# Altium project Edge_logic_analyzer_P1.PrjPcb (part 1 of 3)
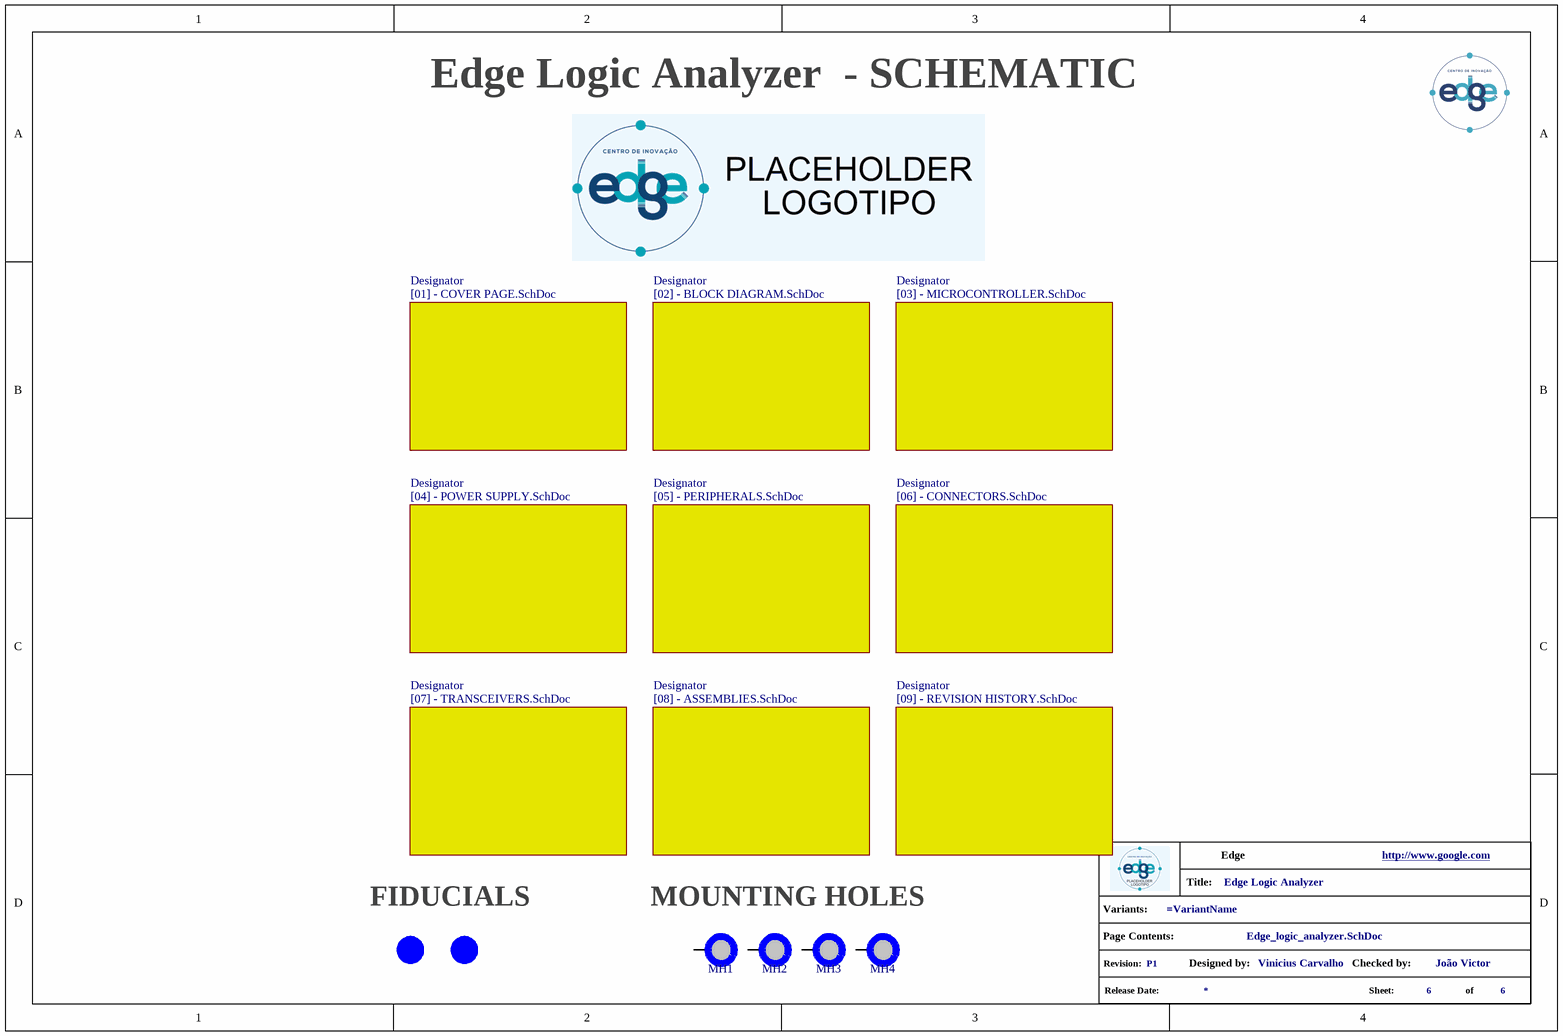
[diagram p0: Edge_logic_analyzer.SchDoc]
CheckedProject: João Victor; Company: Edge; DesignedProject: Vinicius Carvalho; TitleProject: Edge Logic Analyzer; VersionRevision: P1; Website: http://www.google.com
10 sheets, 126 parts. Net scope: flat (ports and power ports of the same name join across sheets).
Board file: Edge_logic_analyzer.PcbDoc
Sheets:
  Edge_logic_analyzer.SchDoc
    Designator = [02] - BLOCK DIAGRAM.SchDoc
    Designator = [03] - MICROCONTROLLER.SchDoc
    Designator = [01] - COVER PAGE.SchDoc
    Designator = [04] - POWER SUPPLY.SchDoc
    Designator = [06] - CONNECTORS.SchDoc
    Designator = [05] - PERIPHERALS.SchDoc
    Designator = [07] - TRANSCEIVERS.SchDoc
    Designator = [09] - REVISION HISTORY.SchDoc
    Designator = [08] - ASSEMBLIES.SchDoc

## Sheet Edge_logic_analyzer.SchDoc
size A4; DocumentNumber: 6; SheetNumber: 6; SheetTotal: 6

### Parts
(Parts that share a designator on the sheet are numbered #1, #2 ... from top to bottom, then left to right.)
*?#1  info_project  (value not drawn)  (graphical)
FID1  FID_40X1.20  [FID_40X1.20]  (value not drawn)  (no BOM)
FID2  FID_40X1.20  [FID_40X1.20]  (value not drawn)  (no BOM)
MH1  MH_7.4MMC_3.2MMD  [MH_7.4MMC_3.2MMD]  (value not drawn)  (no BOM)
MH2  MH_7.4MMC_3.2MMD  [MH_7.4MMC_3.2MMD]  (value not drawn)  (no BOM)
MH3  MH_7.4MMC_3.2MMD  [MH_7.4MMC_3.2MMD]  (value not drawn)  (no BOM)
MH4  MH_7.4MMC_3.2MMD  [MH_7.4MMC_3.2MMD]  (value not drawn)  (no BOM)

### Sub-sheets
Designator = [02] - BLOCK DIAGRAM.SchDoc: no entries
Designator = [03] - MICROCONTROLLER.SchDoc: no entries
Designator = [01] - COVER PAGE.SchDoc: no entries
Designator = [04] - POWER SUPPLY.SchDoc: no entries
Designator = [06] - CONNECTORS.SchDoc: no entries
Designator = [05] - PERIPHERALS.SchDoc: no entries
Designator = [07] - TRANSCEIVERS.SchDoc: no entries
Designator = [09] - REVISION HISTORY.SchDoc: no entries
Designator = [08] - ASSEMBLIES.SchDoc: no entries

### Nets

Not connected (* = marked no-connect by the designer): MH1 1; MH2 1; MH3 1; MH4 1

### Notes on the sheet
- - SCHEMATIC
- FIDUCIALS
- MOUNTING HOLES
- (in symbol info_project) Title:; Variants:; Page Contents:; Revision:; Designed by:; Checked by:; Release Date:; Sheet:; of

### Library data of the parts
FID1 FID2 = FID_40X1.20: Fiducials
MH1-MH4 = MH_7.4MMC_3.2MMD: Mounting Hole 7.4mm Diameter 3.2mm Drill

## Sheet [02] - BLOCK DIAGRAM.SchDoc
size A2; DocumentNumber: 2; SheetNumber: 2; SheetTotal: 6; PageSetup: Record=PageOptions|CenterHorizontal=True|CenterVertical=True|PrintScale=0.52|XCorrection=1.00|YCorrection=1.00|PrintKind=1|BorderSize=5000000|LeftOffset=0|BottomOffset=0|Orientation=2|PaperLength=1000|PaperWidth=1000|Scale=100|PaperSource=4|PrintQuality=600|MediaType=1|DitherType=10|PrintScaleMode=1|PaperKind=A4|PaperIndex=9
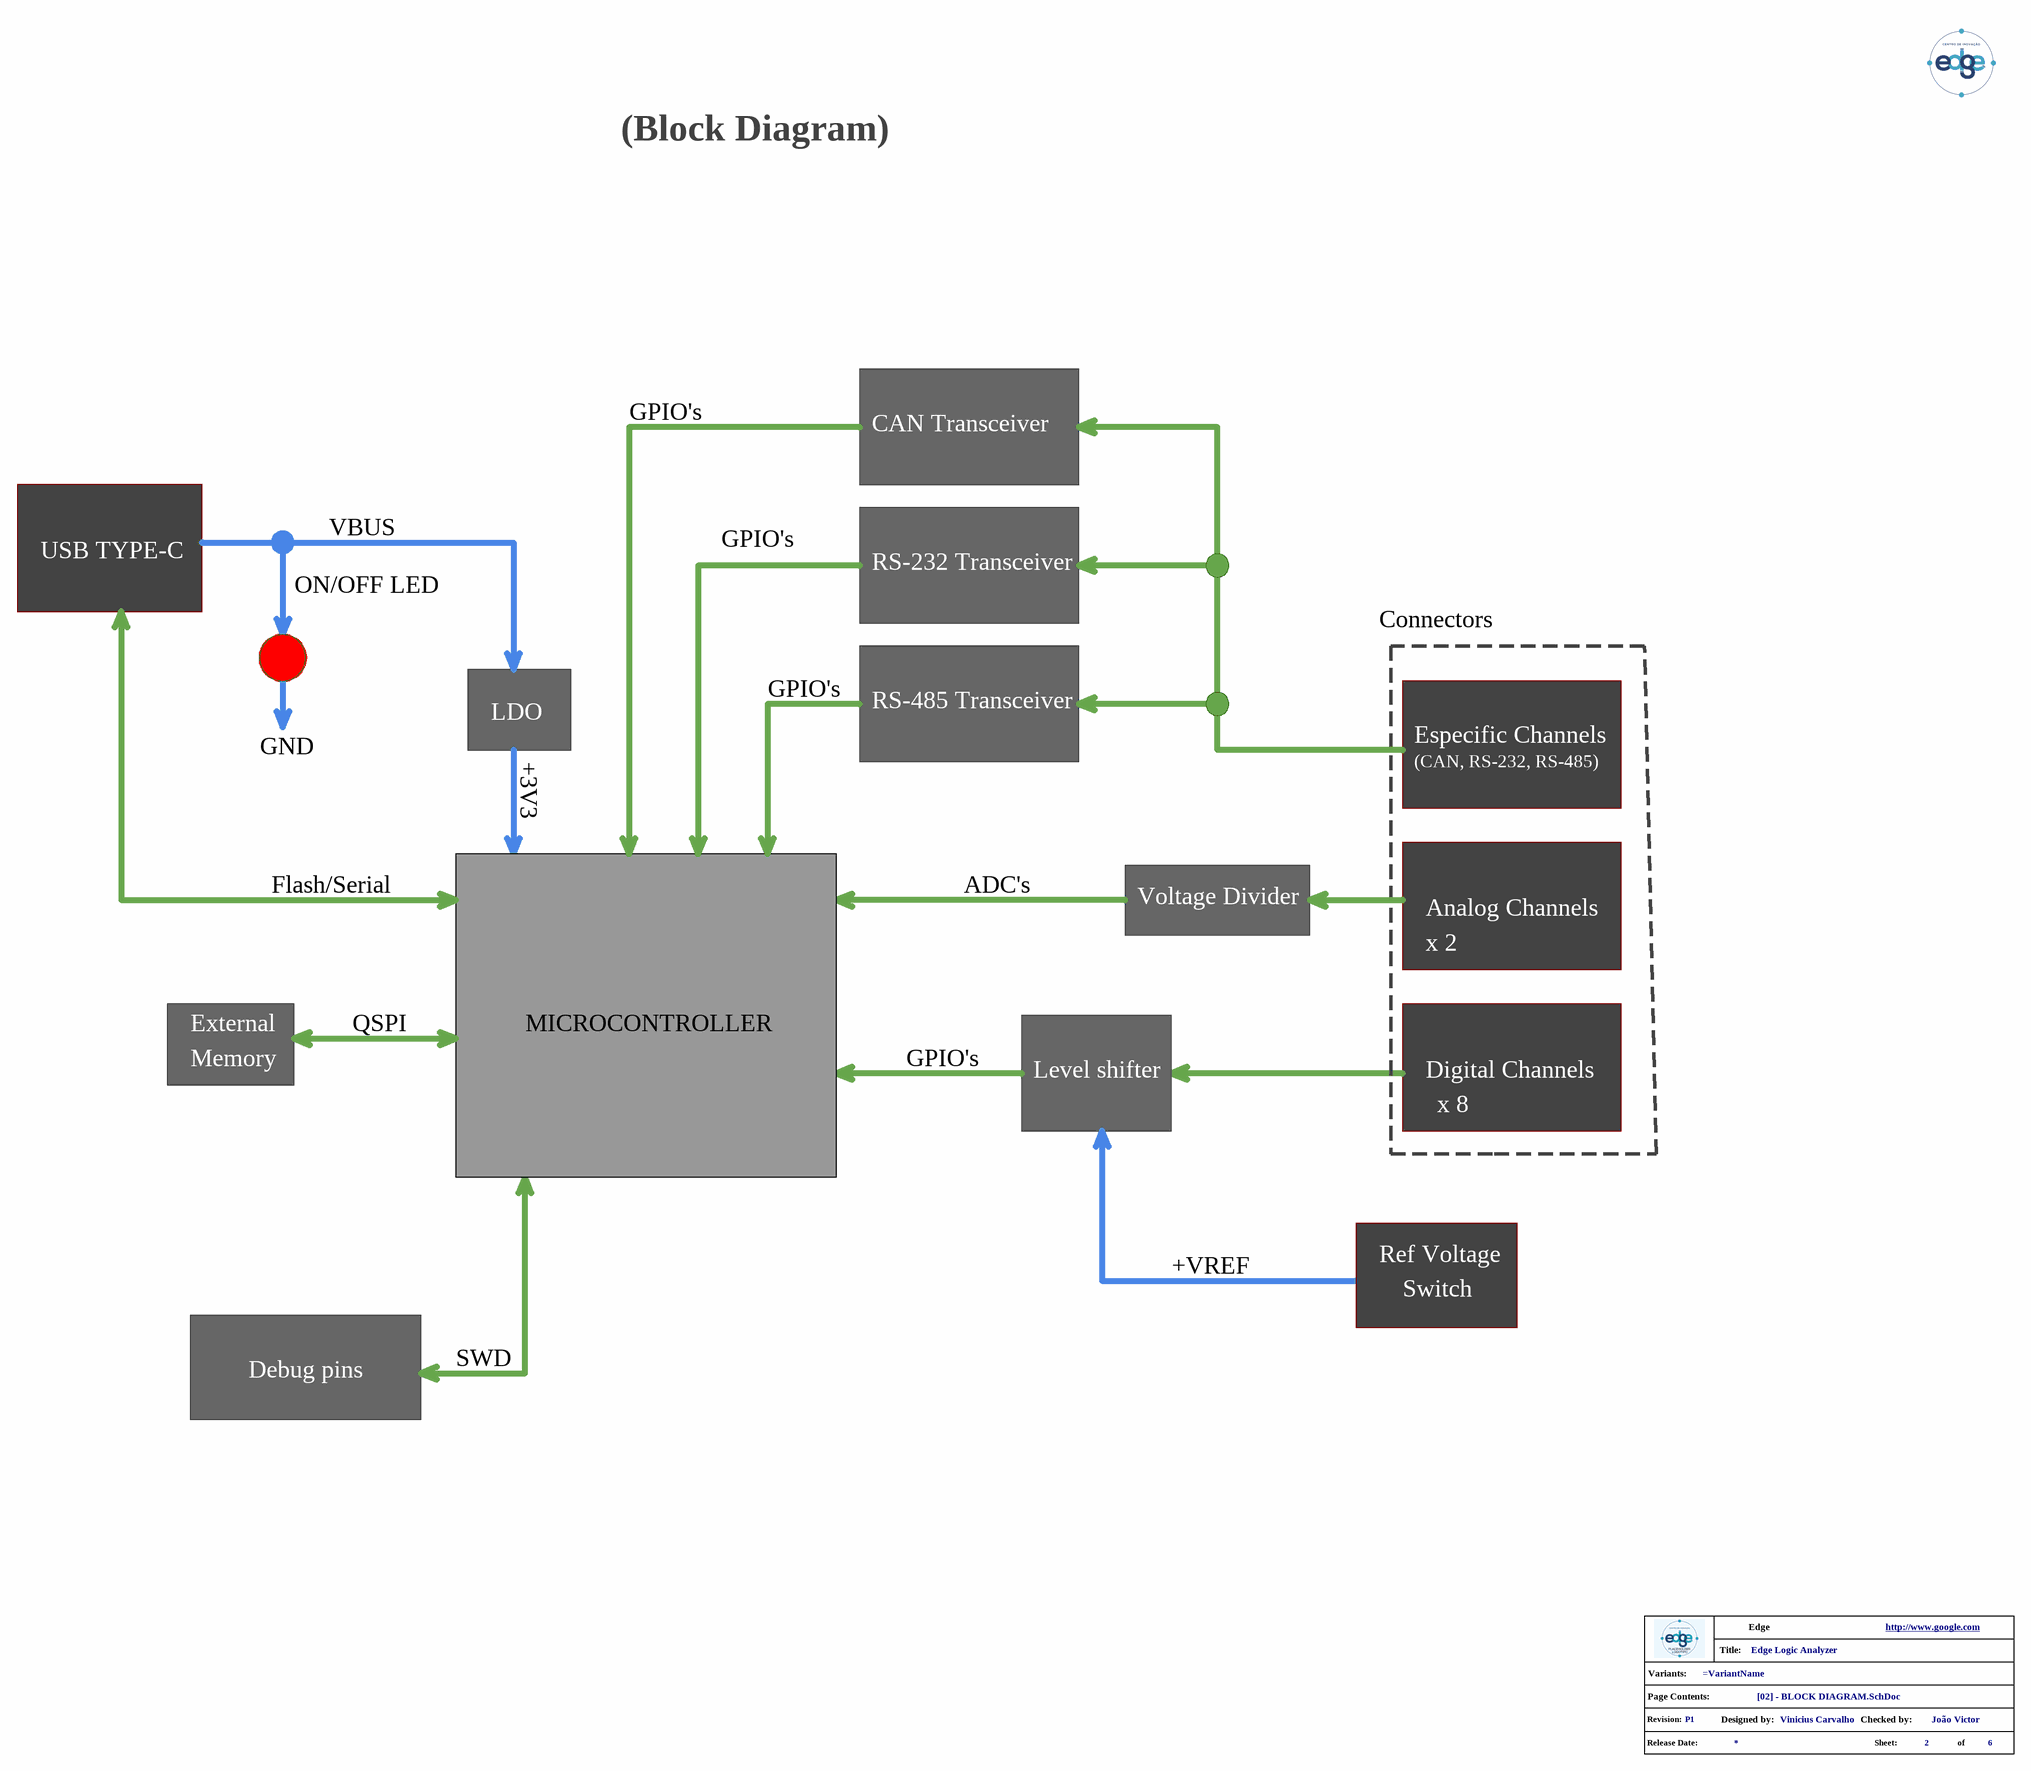
[diagram p1: [02] - BLOCK DIAGRAM.SchDoc]

### Parts
(Parts that share a designator on the sheet are numbered #1, #2 ... from top to bottom, then left to right.)
*?#2  info_project  (value not drawn)  (graphical)

### Notes on the sheet
- (Block Diagram)
- GPIO's
- CAN Transceiver
- VBUS
- USB TYPE-C
- ON/OFF LED
- RS-232 Transceiver
- Connectors
- RS-485 Transceiver
- GND
- LDO
- +3V3
- Especific Channels
- (CAN, RS-232, RS-485)
- Flash/Serial
- ADC's
- Voltage Divider
- Analog Channels
- x 2
- External
- QSPI
- MICROCONTROLLER
- Memory
- Level shifter
- Digital Channels
- x 8
- +VREF
- Ref Voltage
- Switch
- Debug pins
- SWD
- (in symbol info_project) Title:; Variants:; Page Contents:; Revision:; Designed by:; Checked by:; Release Date:; Sheet:; of

## Sheet [03] - MICROCONTROLLER.SchDoc
size A3; DocumentNumber: 3; SheetNumber: 3; SheetTotal: 6
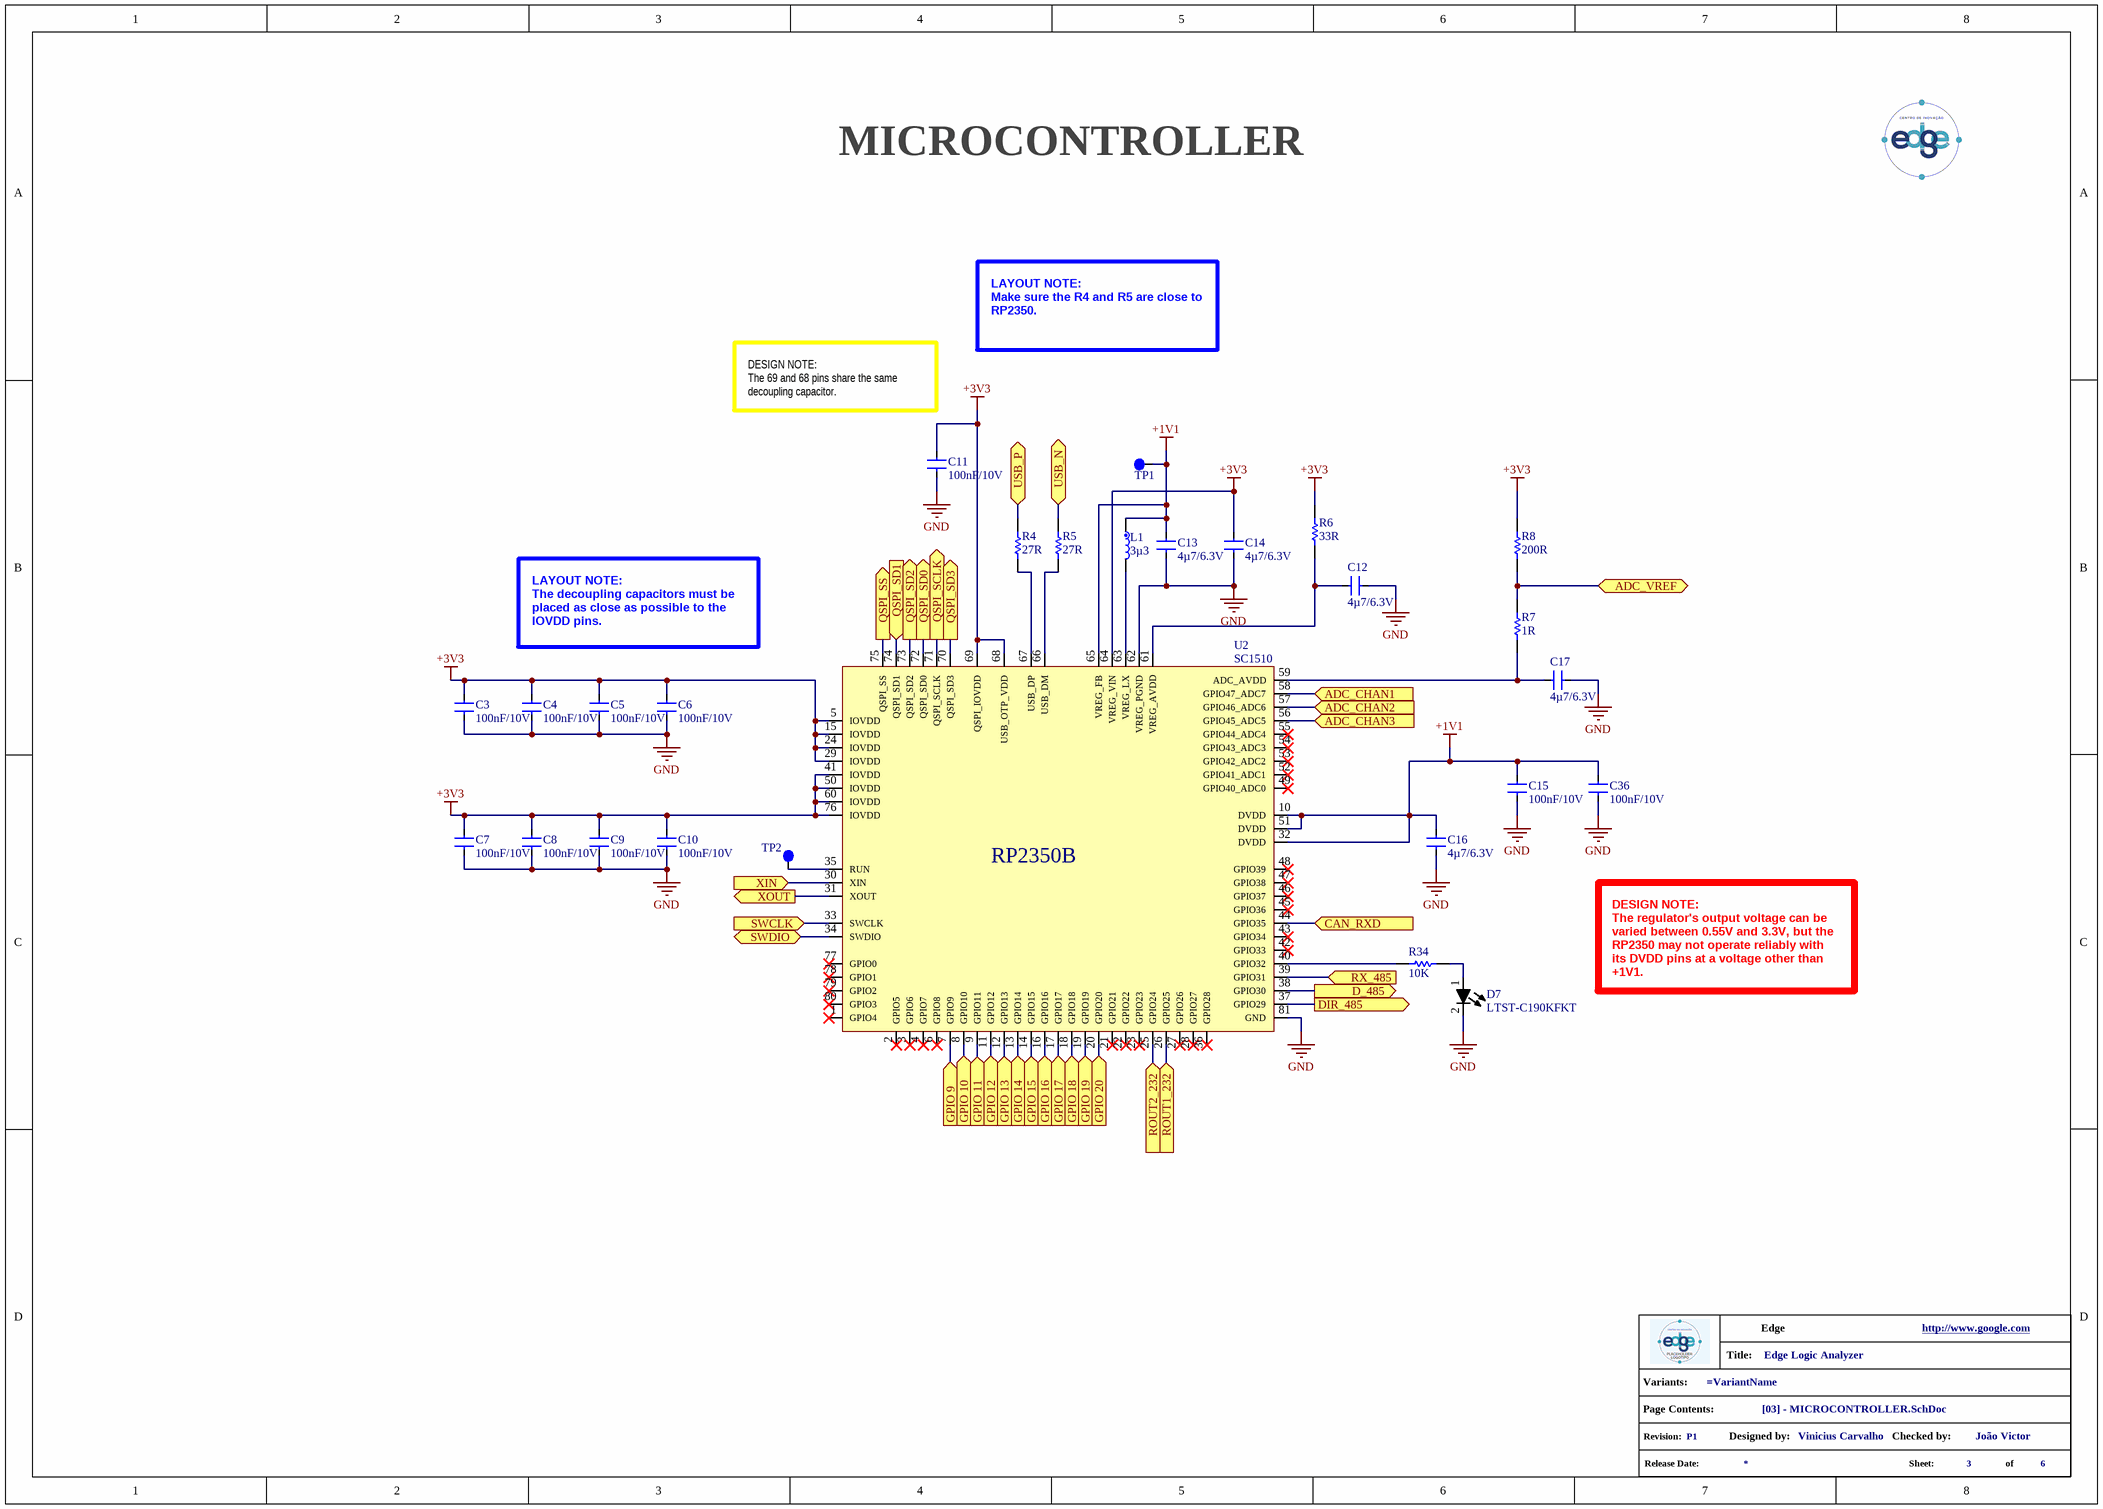
[diagram p2: [03] - MICROCONTROLLER.SchDoc]

### Parts
(Parts that share a designator on the sheet are numbered #1, #2 ... from top to bottom, then left to right.)
*?#3  info_project  (value not drawn)  (graphical)
C3  100nF/10V  [C0402]
C4  100nF/10V  [C0402]
C5  100nF/10V  [C0402]
C6  100nF/10V  [C0402]
C7  100nF/10V  [C0402]
C8  100nF/10V  [C0402]
C9  100nF/10V  [C0402]
C10  100nF/10V  [C0402]
C11  100nF/10V  [C0402]
C12  4µ7/6.3V  [C0402]
C13  4µ7/6.3V  [C0402]
C14  4µ7/6.3V  [C0402]
C15  100nF/10V  [C0402]
C16  4µ7/6.3V  [C0402]
C17  4µ7/6.3V  [C0402]
C36  100nF/10V  [C0402]
D7  LTST-C190KFKT  [LTST-C190KFKT]
L1  3µ3  [L0806 - RP2350]
R4  27R  [R0402]
R5  27R  [R0402]
R6  33R  [R0402]
R7  1R  [R0603]
R8  200R  [R0402]
R34  10K  [R0402]
TP1  TestPoint  [Test Point]  (value not drawn)  (no BOM)
TP2  TestPoint  [Test Point]  (value not drawn)  (no BOM)
U2  SC1510  [SC1510]

### Ports
ADC_CHAN1 (in), ADC_CHAN2 (in), ADC_CHAN3 (in), ADC_VREF (bidir), CAN_RXD (in), D_485 (out), DIR_485 (out), GPIO 9 (in), GPIO 10 (in), GPIO 11 (in), GPIO 12 (in), GPIO 13 (in), GPIO 14 (in), GPIO 15 (in), GPIO 16 (in), GPIO 17 (in), GPIO 18 (in), GPIO 19 (in), GPIO 20 (in), QSPI_SCLK (out), QSPI_SD0 (out), QSPI_SD1 (in), QSPI_SD2 (out), QSPI_SD3 (out), QSPI_SS (out), ROUT1_232 (in), ROUT2_232 (in), RX_485 (in), SWCLK (in), SWDIO (bidir), USB_N (bidir), USB_P (bidir), XIN (in), XOUT (out)

### Nets
+1V1: C13.2 C15.2 C16.2 C36.2 L1.1 TP1.1 U2.10(DVDD) U2.32(DVDD) U2.51(DVDD) U2.65(VREG_FB)
+3V3: C3.1 C4.1 C5.1 C6.2 C7.1 C8.1 C9.1 C10.2 C11.1 C14.2 R6.2 R8.2 U2.5(IOVDD) U2.15(IOVDD) U2.24(IOVDD) U2.29(IOVDD) U2.41(IOVDD) U2.50(IOVDD) U2.60(IOVDD) U2.64(VREG_VIN) U2.68(USB_OTP_VDD) U2.69(QSPI_IOVDD) U2.76(IOVDD)
GND: C3.2 C4.2 C5.2 C6.1 C7.2 C8.2 C9.2 C10.1 C11.2 C12.2 C13.1 C14.1 C15.1 C16.1 C17.2 C36.1 D7.2 U2.62(VREG_PGND) U2.81(GND)
QSPI_SS: U2.75(QSPI_SS) ; port QSPI_SS
USB_N: R5.2 ; port USB_N
USB_P: R4.2 ; port USB_P
NetC12_1: C12.1 R6.1 U2.61(VREG_AVDD)
NetC17_1: C17.1 R7.1 U2.59(ADC_AVDD)
NetC18_2: U2.30(XIN) ; port XIN
NetCN4_1: R7.2 R8.1 ; port ADC_VREF
NetD7_1: D7.1 R34.2
NetL1_2: L1.2 U2.63(VREG_LX)
NetR4_1: R4.1 U2.67(USB_DP)
NetR5_1: R5.1 U2.66(USB_DM)
NetR10_1: U2.34(SWDIO) ; port SWDIO
NetR11_1: U2.33(SWCLK) ; port SWCLK
NetR12_1: U2.57(GPIO46_ADC6) ; port ADC_CHAN2
NetR13_1: U2.56(GPIO45_ADC5) ; port ADC_CHAN3
NetR18_1: U2.44(GPIO35) ; port CAN_RXD
NetR22_1: U2.39(GPIO31) ; port RX_485
NetR23_2: U2.37(GPIO29) ; port DIR_485
NetR30_2: U2.31(XOUT) ; port XOUT
NetR31_1: U2.58(GPIO47_ADC7) ; port ADC_CHAN1
NetR34_1: R34.1 U2.40(GPIO32)
NetTP2_1: TP2.1 U2.35(RUN)
NetTP6_1: U2.26(GPIO25) ; port ROUT1_232
NetTP7_1: U2.25(GPIO24) ; port ROUT2_232
NetU2_7: U2.7(GPIO9) ; port GPIO 9
NetU2_8: U2.8(GPIO10) ; port GPIO 10
NetU2_9: U2.9(GPIO11) ; port GPIO 11
NetU2_11: U2.11(GPIO12) ; port GPIO 12
NetU2_12: U2.12(GPIO13) ; port GPIO 13
NetU2_13: U2.13(GPIO14) ; port GPIO 14
NetU2_14: U2.14(GPIO15) ; port GPIO 15
NetU2_16: U2.16(GPIO16) ; port GPIO 16
NetU2_17: U2.17(GPIO17) ; port GPIO 17
NetU2_18: U2.18(GPIO18) ; port GPIO 18
NetU2_19: U2.19(GPIO19) ; port GPIO 19
NetU2_20: U2.20(GPIO20) ; port GPIO 20
NetU2_38: U2.38(GPIO30) ; port D_485
NetU2_70: U2.70(QSPI_SD3) ; port QSPI_SD3
NetU2_71: U2.71(QSPI_SCLK) ; port QSPI_SCLK
NetU2_72: U2.72(QSPI_SD0) ; port QSPI_SD0
NetU2_73: U2.73(QSPI_SD2) ; port QSPI_SD2
NetU2_74: U2.74(QSPI_SD1) ; port QSPI_SD1

Not connected (* = marked no-connect by the designer): U2 1(GPIO4)* 2(GPIO5)* 3(GPIO6)* 4(GPIO7)* 6(GPIO8)* 21(GPIO21)* 22(GPIO22)* 23(GPIO23)* 27(GPIO26)* 28(GPIO27)* 36(GPIO28)* 42(GPIO33)* 43(GPIO34)* 45(GPIO36)* 46(GPIO37)* 47(GPIO38)* 48(GPIO39)* 49(GPIO40_ADC0)* 52(GPIO41_ADC1)* 53(GPIO42_ADC2)* 54(GPIO43_ADC3)* 55(GPIO44_ADC4)* 77(GPIO0)* 78(GPIO1)* 79(GPIO2)* 80(GPIO3)*

### Notes on the sheet
- MICROCONTROLLER
- LAYOUT NOTE:
  Make sure the R4 and R5 are close to RP2350.
- (near C11) DESIGN NOTE:
  The 69 and 68 pins share the same decoupling capacitor.
- LAYOUT NOTE:
  The decoupling capacitors must be placed as close as possible to the IOVDD pins.
- DESIGN NOTE:
  The regulator's output voltage can be varied between 0.55V and 3.3V, but the RP2350 may not operate reliably with its DVDD pins at a voltage other than +1V1.
- (in symbol info_project) Title:; Variants:; Page Contents:; Revision:; Designed by:; Checked by:; Release Date:; Sheet:; of
- (in symbol SC1510) RP2350B

### Library data of the parts
C3-C11 C15 C36 = CL05B104KP5NNNC: MLCC - 100nF 10V X7R 0402 ±10% Ceramic Capacitor; Manufacturer 1: Samsung; Multilayer: Yes; .Mounting: SMT; Supplier: Digikey; Supplier Part Number: 1276-1002-1-ND; RoHS: Yes; Category: Ceramic Capacitors; Stock: 29591550; Pricing: 1=0,08, 10=0,004, 100=0,0036, 1000=0,0032 (USD); Mounting Technology: Surface Mount; Pins: 2; Dielectric Material: Ceramic; Package Shape: Rectangular; Case/Package: 0402; Terminal Finish: Nickel; Min Operating Temperature: -55°C; Max Operating Temperature: 125°C; JESD-609 Code: e3; Value: 100nF; Capacitor Type: Ceramic; Tolerance  (fill in as +-): 10%; Package Style: SMTMeter; Packaging: Tape and Reel; Tolerance (fill in as +-): 10%; Rated DC Voltage (URdc): 10V; Temperature Characteristics Code: X7R; Termination: Wraparound; Length: 1mm; Width: 0.5mm; Height: 0.5mm; Reach SVHC Compliant: Yes; RoHS Compliant: Yes; ComponentLink1URL: https://datasheet.ciiva.com:443/pdfs/VipMasterIC/IC/SEMS/SEMS-S-A0008523115/SEMS-S-A0008523129-1.pdf?src-supplier=IHS+Markit; ComponentLink1Description: https://datasheet.ciiva.com:443/pdfs/VipMasterIC/IC/SEMS/SEMS-S-A0008523115/SEMS-S-A0008523129-1.pdf?src-supplier=IHS+Markit; ComponentLink2URL: https://datasheet.ciiva.com/15165/getdatasheetpartid-37100-15165107.pdf?src-supplier=Verical; ComponentLink2Description: https://datasheet.ciiva.com/15165/getdatasheetpartid-37100-15165107.pdf?src-supplier=Verical; ComponentLink3URL: https://datasheet.ciiva.com/16498/cl05b104kq5nnnc-16498491.pdf?src-supplier=Future+Electronics; ComponentLink3Description: https://datasheet.ciiva.com/16498/cl05b104kq5nnnc-16498491.pdf?src-supplier=Future+Electronics; .PCBChecked: *; .SCHChecked: *; Manufacturer Part Number 1: CL05B104KP5NNNC
C12-C14 C16 C17 = CL05A475KQ5NRNC: MLCC - 4.7 µF 6.3V 0402 X5R ±10%  Ceramic Capacitor X5R; Manufacturer 1: Samsung; Value: 4.7uF; Multilayer: Yes; .Mounting: SMT; Supplier: Digikey; Supplier Part Number: 1276-1481-1-ND; RoHS: Yes; Category: Ceramic Capacitors; Stock: 761086; Pricing: 1=0,08, 10=0,026, 100=0,016, 1000=0,0112, 2500=0,0096 (USD); Mounting Technology: Surface Mount; Pins: 2; Dielectric Material: Ceramic; Package Shape: Rectangular; Case/Package: 0402; Terminal Finish: Nickel; Min Operating Temperature: -55°C; Max Operating Temperature: 85°C; JESD-609 Code: e3; Capacitor Type: Ceramic; Tolerance  (fill in as +-): 10%; Packaging: Tape and Reel; Tolerance (fill in as +-): 10%; Rated DC Voltage (URdc): 6.3V; Temperature Characteristics Code: X5R; Termination: Wraparound; Reach SVHC Compliant: Yes; RoHS Compliant: Yes; ComponentLink1URL: https://datasheet.ciiva.com:443/pdfs/VipMasterIC/IC/SEMS/SEMS-S-A0008521219/SEMS-S-A0008521124-1.pdf?src-supplier=IHS+Markit; ComponentLink1Description: https://datasheet.ciiva.com:443/pdfs/VipMasterIC/IC/SEMS/SEMS-S-A0008521219/SEMS-S-A0008521124-1.pdf?src-supplier=IHS+Markit; ComponentLink2URL: https://datasheet.ciiva.com/25793/cl05a475kq5nrnc-25793634.pdf?src-supplier=Digikey; ComponentLink2Description: https://datasheet.ciiva.com/25793/cl05a475kq5nrnc-25793634.pdf?src-supplier=Digikey; ComponentLink3URL: https://datasheet.ciiva.com/26838/getdatasheetpartid-353228-26838196.pdf?src-supplier=Verical; ComponentLink3Description: https://datasheet.ciiva.com/26838/getdatasheetpartid-353228-26838196.pdf?src-supplier=Verical; .PCBChecked: *; .SCHChecked: *; Manufacturer Part Number 1: CL05A475KQ5NRNC
D7 = LTST-C190KFKT: DIODE - LED  Orange 605nm LED Indication - Discrete 2V 0603 (1608 Metric); Manufacturer 1: Vishay Lite-On; Shape: Rectangular; Optoelectronic Device Type: SINGLE COLOR LED; Lens Style: WATER CLEAR; Forward Current: 30mA; Forward Voltage: 2.4V; Luminous Intensity-Min: 130cd; Luminous Intensity-Nom: 90mcd; Channels: 1; Reverse Voltage-Max: 5V; Viewing Angle: 130°; Overall Height: 0.8mm; .Mounting: SMT; Supplier: Arrow Electronics; Supplier Part Number: LTST-C190KFKT; Manufacturer Part Number 1: LTST-C190KFKT; RoHS: Yes; Category: LEDs; Stock: 8000; Pricing: 4000=0,0337, 8000=0,0285, 24000=0,0224, 48000=0,022, 100000=0,0218 (USD); Mounting Technology: Surface Mount; Pins: 2; Color: Orange; Color@wavelength: Orange; Terminal Finish: Tin; Min Operating Temperature: -55°C; Max Operating Temperature: 85°C; JESD-609 Code: e3; Packaging: Tape and Reel; Size: 1.1mm; Terminal Pitch: 1.5mm; Reach SVHC Compliant: Yes; RoHS Compliant: Yes; ComponentLink1URL: https://datasheet.ciiva.com:443/pdfs/VipMasterIC/IC/LITE/LITE-S-A0008267416/LITE-S-A0008267416-1.pdf?src-supplier=IHS+Markit; ComponentLink1Description: https://datasheet.ciiva.com:443/pdfs/VipMasterIC/IC/LITE/LITE-S-A0008267416/LITE-S-A0008267416-1.pdf?src-supplier=IHS+Markit; ComponentLink2URL: https://datasheet.ciiva.com/11774/0900766b80dc02a7-11774744.pdf?src-supplier=Rs; ComponentLink2Description: https://datasheet.ciiva.com/11774/0900766b80dc02a7-11774744.pdf?src-supplier=Rs; ComponentLink3URL: https://datasheet.ciiva.com/12400/100-ltst-c190kfkt-53640-12400769.pdf?src-supplier=Mouser; ComponentLink3Description: https://datasheet.ciiva.com/12400/100-ltst-c190kfkt-53640-12400769.pdf?src-supplier=Mouser; ComponentLink4URL: https://datasheet.ciiva.com/15201/getdatasheetpartid-309341-15201388.pdf?src-supplier=Verical; ComponentLink4Description: https://datasheet.ciiva.com/15201/getdatasheetpartid-309341-15201388.pdf?src-supplier=Verical; ComponentLink5URL: https://datasheet.ciiva.com/16396/lite-on20ltst-c190kfkt-16396246.pdf?src-supplier=Future+Electronics; ComponentLink5Description: https://datasheet.ciiva.com/16396/lite-on20ltst-c190kfkt-16396246.pdf?src-supplier=Future+Electronics; ComponentLink6URL: https://datasheet.ciiva.com/2109/s-110-ltst-c190kfkt-2109976.pdf?src-supplier=Digikey; ComponentLink6Description: https://datasheet.ciiva.com/2109/s-110-ltst-c190kfkt-2109976.pdf?src-supplier=Digikey; ComponentLink7URL: https://datasheet.ciiva.com/2109/s-110-ltst-c190kfkt-2109977.pdf?src-supplier=Digikey; ComponentLink7Description: https://datasheet.ciiva.com/2109/s-110-ltst-c190kfkt-2109977.pdf?src-supplier=Digikey; ComponentLink8URL: https://datasheet.ciiva.com/2109/s-110-ltst-c190kfkt-2109978.pdf?src-supplier=Digikey; ComponentLink8Description: https://datasheet.ciiva.com/2109/s-110-ltst-c190kfkt-2109978.pdf?src-supplier=Digikey; .SCHCheked: *; .PCBChecked: *
L1 = AOTA-B201610S3R3-101-T: IND - 3.3 µH 2.1A 0806 140mOhm Shielded Molded Inductor  Max 0806 (2016 Metric); Manufacturer 1: Abracon; .Mounting: SMT; Supplier: Digikey; Supplier Part Number: 535-AOTA-B201610S3R3-101-TCT-ND; RoHS: No; Stock: 2887; Pricing: 1=0,22, 10=0,181, 100=0,1497, 1000=0,12251 (USD); .PCBChecked: *; .SCHChecked: *; Manufacturer Part Number 1: AOTA-B201610S3R3-101-T
R4 R5 = ERJ-2RKF27R0X: RES- 27R 1/10W  0402 ±1% 0.1W Chip Resistor; Manufacturer 1: Panasonic; Power: 100mW; Rated Temperature: 70°C; Working Voltage: 50V; Temperature Coefficient (ppm/Cel): 100; Package Height: 0.35mm; Package Length: 1mm; Package Width: 0.5mm; Reference Standard: AEC-Q200; .Mounting: SMT; Supplier: Digikey; Supplier Part Number: P27.0LCT-ND; RoHS: Yes; Category: Chip SMD Resistors; Stock: 682991; Pricing: 1=0,1, 10=0,028, 100=0,0138, 1000=0,00766, 2500=0,00632, 5000=0,00554 (USD); Mounting Technology: Surface Mount; Pins: 2; Package Shape: Rectangular; Case/Package: 0402; Terminal Finish: Nickel; Min Operating Temperature: -55°C; Max Operating Temperature: 155°C; Tolerance: 1%; JESD-609 Code: e3; Resistor Type: FIXED RESISTOR; Construction: Rectangular; Packaging: Tape and Reel; Value: 27R; Technology: METAL GLAZE/THICK FILM; Termination: Wraparound; Reach SVHC Compliant: Yes; RoHS Compliant: Yes; ComponentLink1URL: https://datasheet.ciiva.com:443/pdfs/VipMasterIC/IC/PANA/PANA-S-A0009889626/PANA-S-A0009889626-1.pdf?src-supplier=IHS+Markit; ComponentLink1Description: https://datasheet.ciiva.com:443/pdfs/VipMasterIC/IC/PANA/PANA-S-A0009889626/PANA-S-A0009889626-1.pdf?src-supplier=IHS+Markit; ComponentLink2URL: https://datasheet.ciiva.com/11821/0900766b80f80784-11821276.pdf?src-supplier=Rs; ComponentLink2Description: https://datasheet.ciiva.com/11821/0900766b80f80784-11821276.pdf?src-supplier=Rs; ComponentLink3URL: https://datasheet.ciiva.com/46373/1678782-46373578.pdf?src-supplier=Element14; ComponentLink3Description: https://datasheet.ciiva.com/46373/1678782-46373578.pdf?src-supplier=Element14; ComponentLink4URL: https://datasheet.ciiva.com/46373/1678782-46373579.pdf?src-supplier=Element14; ComponentLink4Description: https://datasheet.ciiva.com/46373/1678782-46373579.pdf?src-supplier=Element14; ComponentLink5URL: https://datasheet.ciiva.com/22681/1678782-22681159.pdf?src-supplier=Element14; ComponentLink5Description: https://datasheet.ciiva.com/22681/1678782-22681159.pdf?src-supplier=Element14; ComponentLink6URL: https://datasheet.ciiva.com/7891/aoa0000ce2-7891306.pdf?src-supplier=Element14; ComponentLink6Description: https://datasheet.ciiva.com/7891/aoa0000ce2-7891306.pdf?src-supplier=Element14; ComponentLink7URL: https://datasheet.ciiva.com/7891/426256-7891578.pdf?src-supplier=Element14; ComponentLink7Description: https://datasheet.ciiva.com/7891/426256-7891578.pdf?src-supplier=Element14; ComponentLink8URL: https://datasheet.ciiva.com/9191/aoa0000ce2-9191129.pdf?src-supplier=Avnet; ComponentLink8Description: https://datasheet.ciiva.com/9191/aoa0000ce2-9191129.pdf?src-supplier=Avnet; ComponentLink9URL: https://datasheet.ciiva.com/9191/aoa0000ce2-9191130.pdf?src-supplier=Avnet; ComponentLink9Description: https://datasheet.ciiva.com/9191/aoa0000ce2-9191130.pdf?src-supplier=Avnet; ComponentLink10URL: https://datasheet.ciiva.com/43467/1678782-43467165.pdf?src-supplier=Farnell; ComponentLink10Description: https://datasheet.ciiva.com/43467/1678782-43467165.pdf?src-supplier=Farnell; .PCBChecked: *; .SCHChecked: *; Manufacturer Part Number 1: ERJ-2RKF27R0X
R6 = ERJ-2RKF33R0X: RES - 33R 1/10W 0402 ±1%  Chip Resistor; Manufacturer 1: Panasonic; Power: 100mW; Rated Temperature: 70°C; Working Voltage: 50V; Temperature Coefficient (ppm/Cel): 100; Package Height: 0.35mm; Package Length: 1mm; Package Width: 0.5mm; Reference Standard: AEC-Q200; .Mounting: SMT; Supplier: Digikey; Supplier Part Number: P33.0LCT-ND; RoHS: Yes; Category: Chip SMD Resistors; Stock: 66806; Pricing: 1=0,1, 10=0,028, 100=0,0138, 1000=0,00766, 2500=0,00632, 5000=0,00554 (USD); Mounting Technology: Surface Mount; Pins: 2; Package Shape: Rectangular; Case/Package: 0402; Terminal Finish: Nickel; Min Operating Temperature: -55°C; Max Operating Temperature: 155°C; Tolerance: 1%; JESD-609 Code: e3; Resistor Type: FIXED RESISTOR; Construction: Rectangular; Packaging: Tape and Reel; Value: 33R; Technology: METAL GLAZE/THICK FILM; Termination: Wraparound; Reach SVHC Compliant: Yes; RoHS Compliant: Yes; ComponentLink1URL: https://datasheet.ciiva.com:443/pdfs/VipMasterIC/IC/PANA/PANA-S-A0009889626/PANA-S-A0009889626-1.pdf?src-supplier=IHS+Markit; ComponentLink1Description: https://datasheet.ciiva.com:443/pdfs/VipMasterIC/IC/PANA/PANA-S-A0009889626/PANA-S-A0009889626-1.pdf?src-supplier=IHS+Markit; ComponentLink2URL: https://datasheet.ciiva.com/11821/0900766b80f80784-11821292.pdf?src-supplier=Rs; ComponentLink2Description: https://datasheet.ciiva.com/11821/0900766b80f80784-11821292.pdf?src-supplier=Rs; ComponentLink3URL: https://datasheet.ciiva.com/5917/aoa0000ce2-5917817.pdf?src-supplier=Farnell; ComponentLink3Description: https://datasheet.ciiva.com/5917/aoa0000ce2-5917817.pdf?src-supplier=Farnell; ComponentLink4URL: https://datasheet.ciiva.com/43467/1678782-43467173.pdf?src-supplier=Farnell; ComponentLink4Description: https://datasheet.ciiva.com/43467/1678782-43467173.pdf?src-supplier=Farnell; ComponentLink5URL: https://datasheet.ciiva.com/9190/aoa0000ce2-9190507.pdf?src-supplier=Avnet; ComponentLink5Description: https://datasheet.ciiva.com/9190/aoa0000ce2-9190507.pdf?src-supplier=Avnet; ComponentLink6URL: https://datasheet.ciiva.com/24023/aoa0000ce2-24023999.pdf?src-supplier=Mouser; ComponentLink6Description: https://datasheet.ciiva.com/24023/aoa0000ce2-24023999.pdf?src-supplier=Mouser; ComponentLink7URL: https://datasheet.ciiva.com/46373/1678782-46373081.pdf?src-supplier=Element14; ComponentLink7Description: https://datasheet.ciiva.com/46373/1678782-46373081.pdf?src-supplier=Element14; ComponentLink8URL: https://datasheet.ciiva.com/46373/1678782-46373082.pdf?src-supplier=Element14; ComponentLink8Description: https://datasheet.ciiva.com/46373/1678782-46373082.pdf?src-supplier=Element14; ComponentLink9URL: https://datasheet.ciiva.com/7836/aoa0000ce2-7836490.pdf?src-supplier=Element14; ComponentLink9Description: https://datasheet.ciiva.com/7836/aoa0000ce2-7836490.pdf?src-supplier=Element14; ComponentLink10URL: https://datasheet.ciiva.com/7836/426256-7836813.pdf?src-supplier=Element14; ComponentLink10Description: https://datasheet.ciiva.com/7836/426256-7836813.pdf?src-supplier=Element14; ComponentLink11URL: https://datasheet.ciiva.com/16777/70260748-16777705.pdf?src-supplier=Allied+Electronics; ComponentLink11Description: https://datasheet.ciiva.com/16777/70260748-16777705.pdf?src-supplier=Allied+Electronics; .PCBChecked: *; .SCHChecked: *; Manufacturer Part Number 1: ERJ-2RKF33R0X
R7 = RC0603FR-071RL: RES - 1R 1/10W  0603 ±1%; Manufacturer 1: Yageo; Additional Feature: LASER TRIMMABLE; Power: 100mW; Rated Temperature: 70°C; Working Voltage: 75V; Temperature Coefficient (ppm/Cel): 200; Package Height: 0.45mm; Package Length: 1.6mm; Package Width: 0.8mm; .Mounting: SMT; Supplier: Digikey; Supplier Part Number: 311-1.00HRCT-ND; RoHS: Yes; Category: Chip SMD Resistors; Stock: 71794; Pricing: 1=0,11, 10=0,012, 100=0,0112, 1000=0,0102 (USD); Mounting Technology: Surface Mount; Pins: 2; Package Shape: Rectangular; Case/Package: 0603; Terminal Finish: Nickel; Min Operating Temperature: -55°C; Max Operating Temperature: 155°C; Tolerance: 1%; JESD-609 Code: e3; Resistor Type: FIXED RESISTOR; Construction: Chip; Packaging: Tape and Reel; Value: 1R; Technology: METAL GLAZE/THICK FILM; Termination: Wraparound; Reach SVHC Compliant: Yes; RoHS Compliant: Yes; ComponentLink1URL: https://datasheet.ciiva.com:443/pdfs/VipMasterIC/IC/YAGO/YAGO-S-A0008145938/YAGO-S-A0008145938-1.pdf?src-supplier=IHS+Markit; ComponentLink1Description: https://datasheet.ciiva.com:443/pdfs/VipMasterIC/IC/YAGO/YAGO-S-A0008145938/YAGO-S-A0008145938-1.pdf?src-supplier=IHS+Markit; ComponentLink2URL: https://datasheet.ciiva.com/11808/0900766b80f96399-11808162.pdf?src-supplier=Rs; ComponentLink2Description: https://datasheet.ciiva.com/11808/0900766b80f96399-11808162.pdf?src-supplier=Rs; ComponentLink3URL: https://datasheet.ciiva.com/6547/pyu-r-int-thick-7-6547270.pdf?src-supplier=Digikey; ComponentLink3Description: https://datasheet.ciiva.com/6547/pyu-r-int-thick-7-6547270.pdf?src-supplier=Digikey; ComponentLink4URL: https://datasheet.ciiva.com/6547/pyu-r-int-thick-7-6547271.pdf?src-supplier=Digikey; ComponentLink4Description: https://datasheet.ciiva.com/6547/pyu-r-int-thick-7-6547271.pdf?src-supplier=Digikey; ComponentLink5URL: https://datasheet.ciiva.com/7746/1738695-7746296.pdf?src-supplier=Element14; ComponentLink5Description: https://datasheet.ciiva.com/7746/1738695-7746296.pdf?src-supplier=Element14; ComponentLink6URL: https://datasheet.ciiva.com/7746/1738695-7746297.pdf?src-supplier=Element14; ComponentLink6Description: https://datasheet.ciiva.com/7746/1738695-7746297.pdf?src-supplier=Element14; ComponentLink7URL: https://datasheet.ciiva.com/6547/pyu-r-int-thick-7-6547269.pdf?src-supplier=Digikey; ComponentLink7Description: https://datasheet.ciiva.com/6547/pyu-r-int-thick-7-6547269.pdf?src-supplier=Digikey; .PCBChecked: *; .SCHChecked: *; Manufacturer Part Number 1: RC0603FR-071RL
R8 = RT0402BRD07200RL: RES - 200R  0.0625W 0402 0.1%  50V Fixed Resistor, Thin Film; Manufacturer 1: Yageo; Additional Feature: HIGH PRECISION; Power: 62.5mW; Rated Temperature: 70°C; Temperature Coefficient (ppm/Cel): 25; Package Height: 0.3mm; Package Length: 1mm; Package Width: 0.5mm; .Mounting: SMT; Supplier: Avnet; Supplier Part Number: 49AK4062; RoHS: Yes; Category: Chip SMD Resistors; Stock: 8493; Pricing: 1=0,198, 25=0,135, 100=0,098, 250=0,087, 500=0,077 (USD); Mounting Technology: Surface Mount; Pins: 2; Case/Package: 0402; Min Operating Temperature: -55°C; Max Operating Temperature: 155°C; Tolerance: 0.1%; Resistor Type: FIXED RESISTOR; Construction: Chip; Packaging: Tape and Reel; Value: 200R; Technology: THIN FILM; Termination: Wraparound; Working Voltage: 50V; Reach SVHC Compliant: Yes; RoHS Compliant: Yes; ComponentLink1URL: https://datasheet.ciiva.com:443/pdfs/VipMasterIC/IC/YAGO/YAGO-S-A0008510989/YAGO-S-A0008510989-1.pdf?src-supplier=IHS+Markit; ComponentLink1Description: https://datasheet.ciiva.com:443/pdfs/VipMasterIC/IC/YAGO/YAGO-S-A0008510989/YAGO-S-A0008510989-1.pdf?src-supplier=IHS+Markit; ComponentLink2URL: https://datasheet.ciiva.com/12705/pyu-rt-1-to-0-05-rohs-l-4-12705967.pdf?src-supplier=Mouser; ComponentLink2Description: https://datasheet.ciiva.com/12705/pyu-rt-1-to-0-05-rohs-l-4-12705967.pdf?src-supplier=Mouser; ComponentLink3URL: https://datasheet.ciiva.com/46635/pyu-rt-1-to-0-05-rohs-l-5-46635174.pdf?src-supplier=Digikey; ComponentLink3Description: https://datasheet.ciiva.com/46635/pyu-rt-1-to-0-05-rohs-l-5-46635174.pdf?src-supplier=Digikey; ComponentLink4URL: https://datasheet.ciiva.com/2582/pyu-rt-1-to-0-05-rohs-l-4-2582220.pdf?src-supplier=Digikey; ComponentLink4Description: https://datasheet.ciiva.com/2582/pyu-rt-1-to-0-05-rohs-l-4-2582220.pdf?src-supplier=Digikey; .SCHChecked: *; .PCBChecked: *; Manufacturer Part Number 1: RT0402BRD07200RL
R34 = RC1005F103CS: RES - 10K 1/16W 0402 ±1% Chip Resistor; Manufacturer 1: Samsung; Power: 60mW; Value: 10kR; Working Voltage: 50V; Temperature Coefficient (ppm/Cel): 100; Package Height: 0.35mm; Package Length: 1mm; Package Width: 0.5mm; .Mounting: SMT; Supplier: Digikey; Supplier Part Number: 1276-3431-1-ND; Manufacturer Part Number 1: RC1005F103CS; RoHS: Yes; Category: Chip SMD Resistors; Stock: 10935408; Pricing: 1=0,1, 10=0,039, 100=0,0201, 1000=0,01175, 2500=0,0099, 5000=0,00882 (USD); Mounting Technology: Surface Mount; Pins: 2; Package Shape: Rectangular; Case/Package: 0402; Terminal Finish: Nickel; Min Operating Temperature: -55°C; Max Operating Temperature: 125°C; Tolerance: 1%; JESD-609 Code: e3; Resistor Type: FIXED RESISTOR; Construction: Chip; Packaging: Tape and Reel; Technology: METAL GLAZE/THICK FILM; Reach SVHC Compliant: Yes; RoHS Compliant: Yes; ComponentLink1URL: https://datasheet.ciiva.com:443/pdfs/VipMasterIC/IC/SEMS/SEMS-S-A0001326806/SEMS-S-A0001326806-1.pdf?src-supplier=IHS+Markit; ComponentLink1Description: https://datasheet.ciiva.com:443/pdfs/VipMasterIC/IC/SEMS/SEMS-S-A0001326806/SEMS-S-A0001326806-1.pdf?src-supplier=IHS+Markit; ComponentLink2URL: https://datasheet.ciiva.com/15196/getdatasheetpartid-504789-15196214.pdf?src-supplier=Verical; ComponentLink2Description: https://datasheet.ciiva.com/15196/getdatasheetpartid-504789-15196214.pdf?src-supplier=Verical; ComponentLink3URL: https://datasheet.ciiva.com/16481/rcseries-16481007.pdf?src-supplier=Future+Electronics; ComponentLink3Description: https://datasheet.ciiva.com/16481/rcseries-16481007.pdf?src-supplier=Future+Electronics; .PCBChecked: *; .SCHChecked: *
TP1 TP2 = Test_Point: MECH - Test Points
U2 = SC1510: IC - MCU - ARM Microcontrollers - MCU RP2350B 150MHz clock Dual Arm Cortex-M33 cores 520KB RAM 8KB on-chip QFN-80; Manufacturer 1: RASPBERRY-PI; .Mounting: SMT; Datasheet Link: https://datasheets.raspberrypi.com/rp2350/rp2350-datasheet.pdf; Height: 0.9mm; Mouser Part Number: 358-SC1510; Mouser Price/Stock: https://www.mouser.co.uk/ProductDetail/Raspberry-Pi/SC1510?qs=jcD%2FCkGBYePv%252BTwvNgU%2F3g%3D%3D; .SCHChecked: *; .PCBChecked: *; Manufacturer Part Number 1: SC1510

## Sheet [01] - COVER PAGE.SchDoc
size A3; DocumentNumber: 1; SheetNumber: 1; SheetTotal: 6
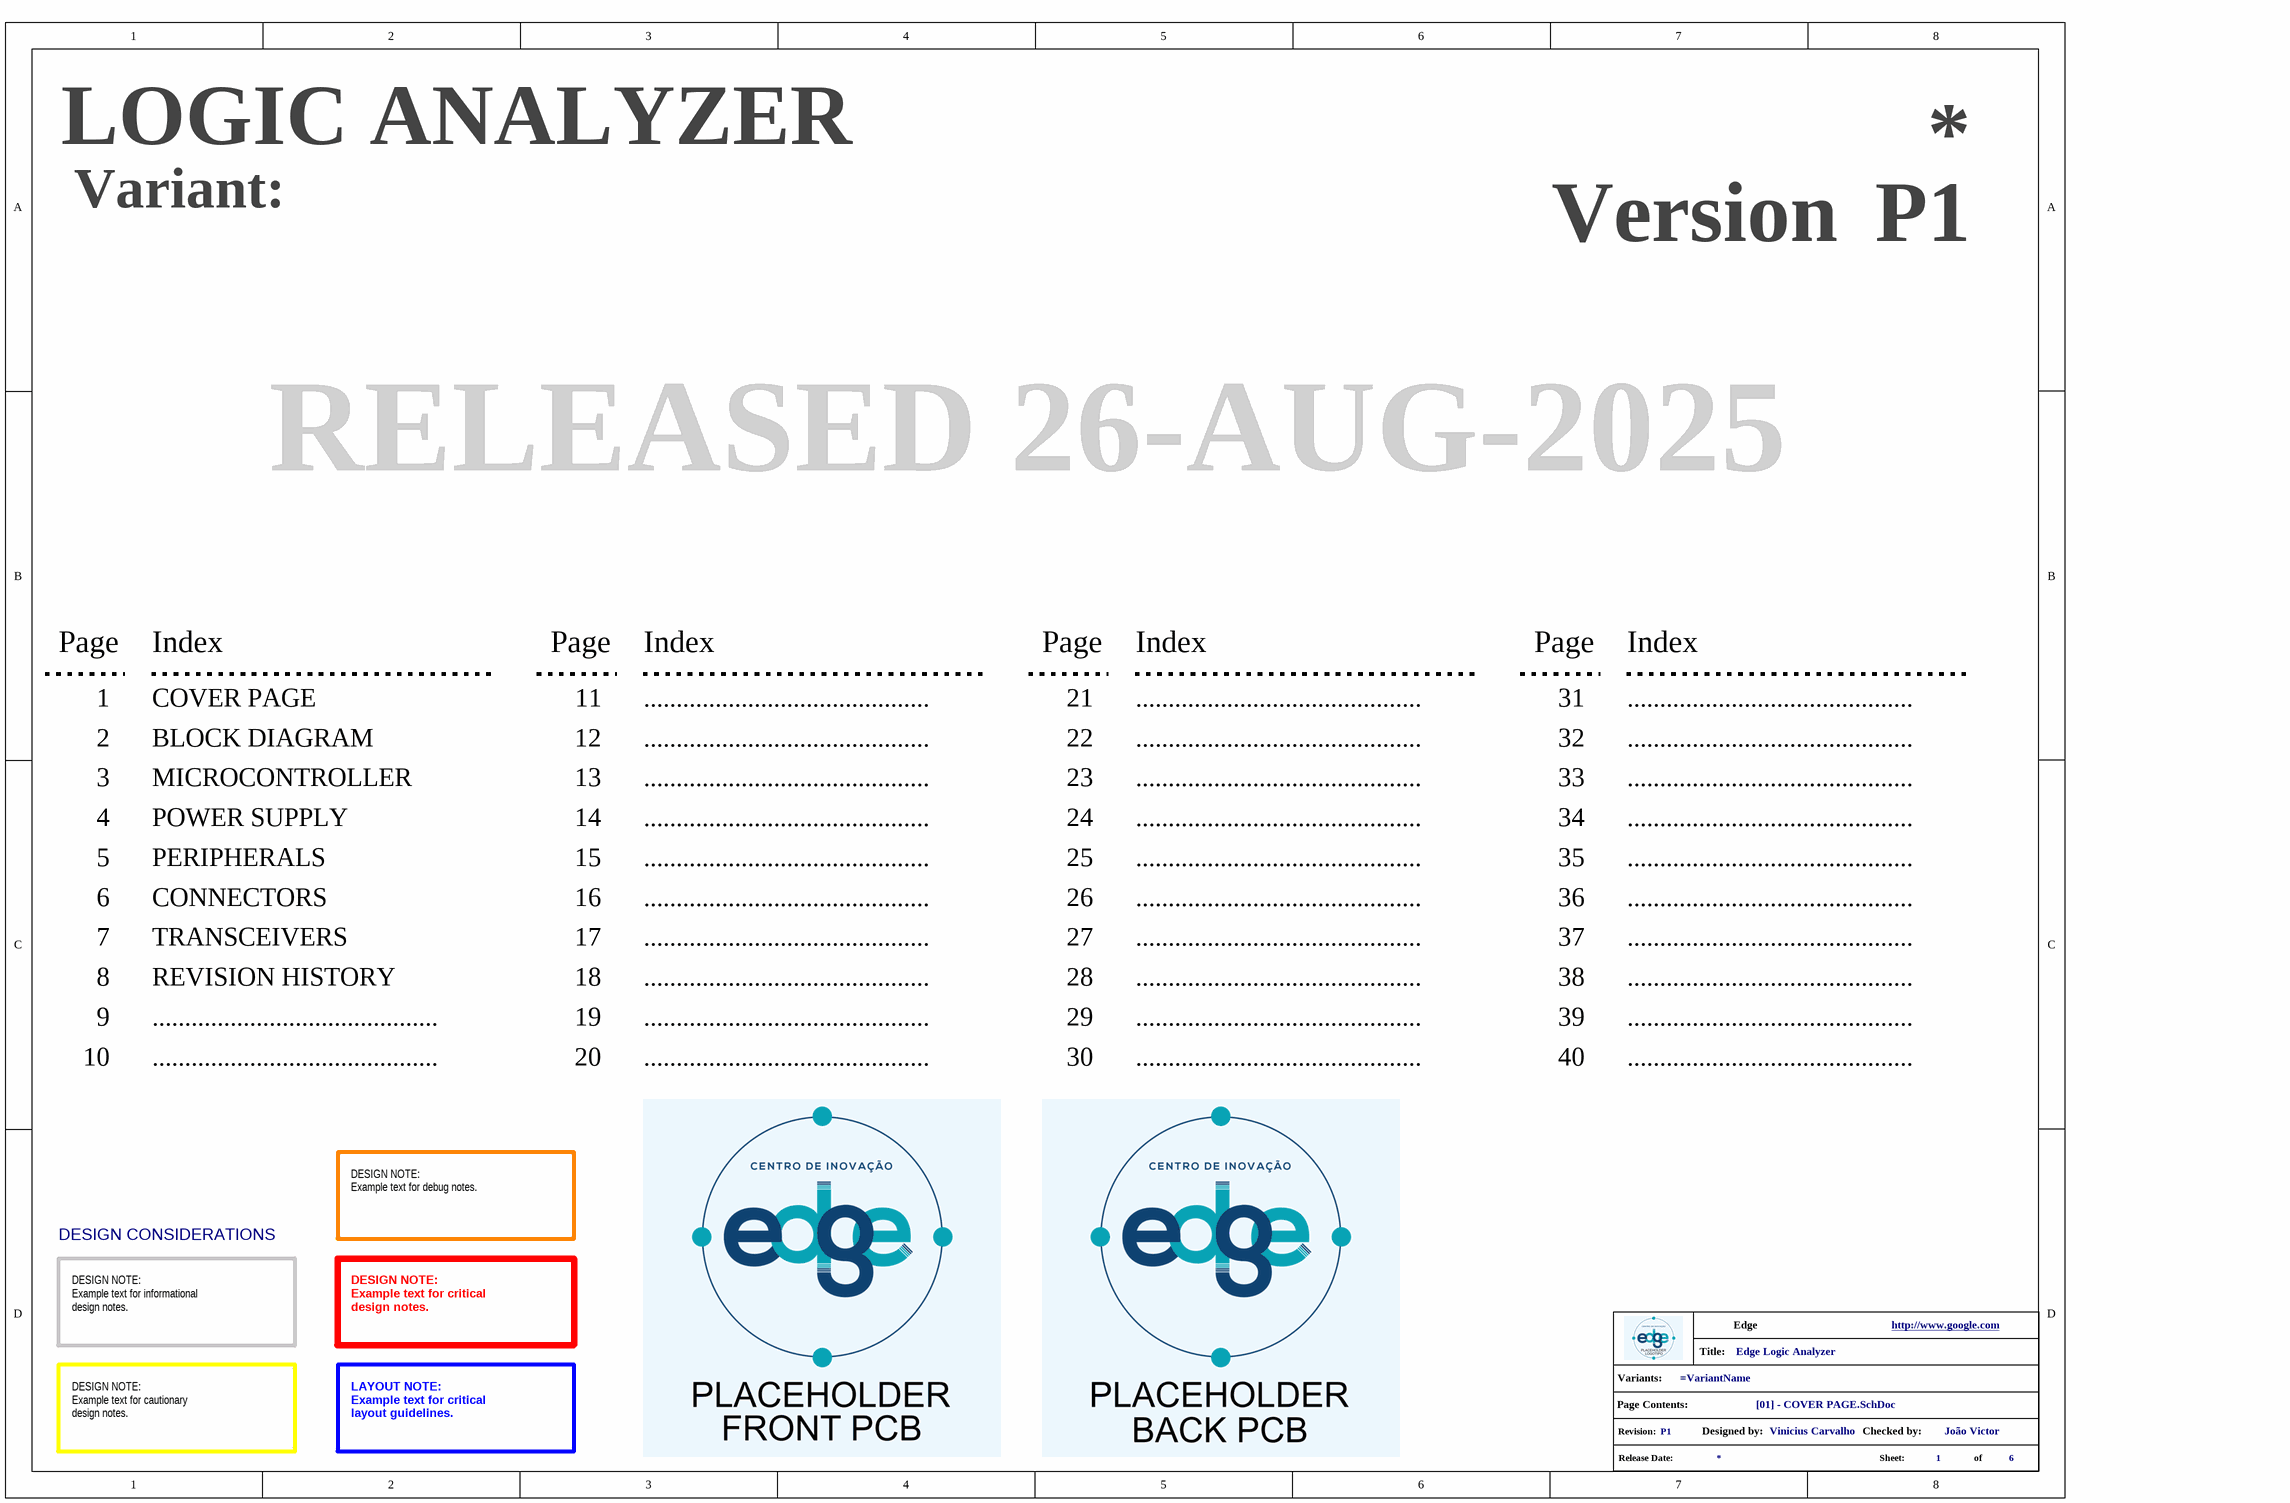
[diagram p3: [01] - COVER PAGE.SchDoc]

### Parts
(Parts that share a designator on the sheet are numbered #1, #2 ... from top to bottom, then left to right.)
*?#4  info_project  (value not drawn)  (graphical)

### Notes on the sheet
- LOGIC ANALYZER
- Variant:
- Version
- RELEASED 26-AUG-2025
- Page
- Index
- 1
- COVER PAGE
- 11
- ............................................
- 21
- 31
- 2
- 3
- BLOCK DIAGRAM
- MICROCONTROLLER
- 12
- 13
- 22
- 23
- 32
- 33
- 4
- POWER SUPPLY
- 14
- 24
- 34
- 5
- 6
- PERIPHERALS
- CONNECTORS
- 15
- 16
- 25
- 26
- 35
- 36
- 7
- 8
- TRANSCEIVERS
- REVISION HISTORY
- 17
- 18
- 27
- 28
- 37
- 38
- 9
- 19
- 29
- 39
- 10
- 20
- 30
- 40
- DESIGN CONSIDERATIONS
- DESIGN NOTE:
  Example text for debug notes.
- DESIGN NOTE:
  Example text for informational
  design notes.
- DESIGN NOTE:
  Example text for critical
  design notes.
- DESIGN NOTE:
  Example text for cautionary
  design notes.
- LAYOUT NOTE:
  Example text for critical
  layout guidelines.
- (in symbol info_project) Title:; Variants:; Page Contents:; Revision:; Designed by:; Checked by:; Release Date:; Sheet:; of

## Sheet [04] - POWER SUPPLY.SchDoc
size A4; DocumentNumber: 4; SheetNumber: 4; SheetTotal: 6
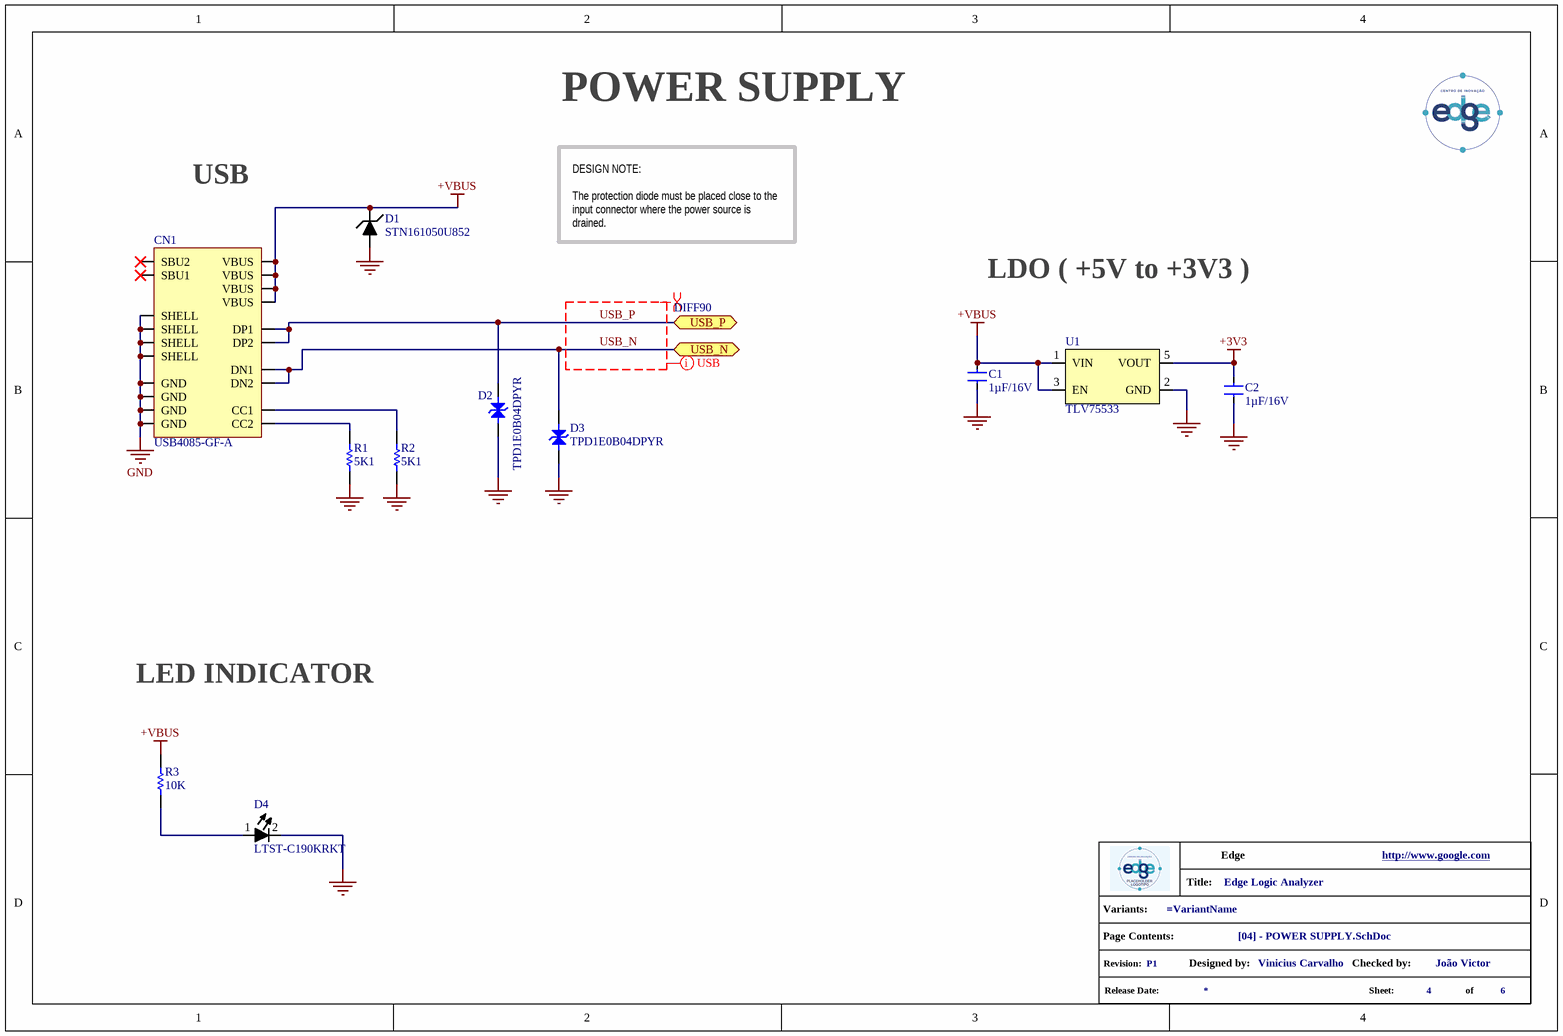
[diagram p4: [04] - POWER SUPPLY.SchDoc]

### Parts
(Parts that share a designator on the sheet are numbered #1, #2 ... from top to bottom, then left to right.)
*?#5  info_project  (value not drawn)  (graphical)
C1  1µF/16V  [C0402]
C2  1µF/16V  [C0402]
CN1  USB4085-GF-A  [USB4085-GF-A]
D1  STN161050U852  [STN161050U852]
D2  TPD1E0B04DPYR  [TPD1E0B04DPYR]
D3  TPD1E0B04DPYR  [TPD1E0B04DPYR]
D4  LTST-C190KRKT  [LTST-C190KRKT]
R1  5K1  [R0402]
R2  5K1  [R0402]
R3  10K  [R0402]
U1  TLV75533  [TLV75533PDBVR]

### Ports
USB_N (bidir), USB_P (bidir)

### Nets
+3V3: C2.1 U1.5(VOUT)
+VBUS: C1.1 CN1.A4(VBUS) CN1.A9(VBUS) CN1.B4(VBUS) CN1.B9(VBUS) D1.1 R3.2 U1.1(VIN) U1.3(EN)
GND: C1.2 C2.2 CN1.A1(GND) CN1.A12(GND) CN1.B1(GND) CN1.B12(GND) CN1.S1(SHELL) CN1.S2(SHELL) CN1.S3(SHELL) CN1.S4(SHELL) D1.2 D2.1 D3.1 D4.2 R1.1 R2.2 U1.2(GND)
USB_N: CN1.A7(DN1) CN1.B7(DN2) D3.2 ; port USB_N
USB_P: CN1.A6(DP1) CN1.B6(DP2) D2.2 ; port USB_P
NetCN1_A5: CN1.A5(CC1) R2.1
NetCN1_B5: CN1.B5(CC2) R1.2
NetD4_1: D4.1 R3.1

Not connected (* = marked no-connect by the designer): CN1 A8(SBU1)* B8(SBU2)*

### Layout directives
differential pair; differential pair class DIFF90: USB_N, USB_P
net class USB: USB_N, USB_P

### Notes on the sheet
- POWER SUPPLY
- USB
- DESIGN NOTE:
  The protection diode must be placed close to the input connector where the power source is drained.
- LDO ( +5V to +3V3 )
- LED INDICATOR
- (in symbol info_project) Title:; Variants:; Page Contents:; Revision:; Designed by:; Checked by:; Release Date:; Sheet:; of

### Library data of the parts
C1 C2 = EMK105BJ105KV-F: MLCC - 1µF 16V 0402 X5R ±10%.; Manufacturer 1: Taiyo Yuden; Dielectric Material: Ceramic; Value: 1uF; Multilayer: Yes; Tolerance  (fill in as +-): 10%; .Mounting: SMT; Supplier 1: Avnet; Supplier Part Number 1: 84R9109; Manufacturer Part Number 1: EMK105BJ105KV-F; RoHS: Yes; Category: Ceramic Capacitors; Stock: 100000; Pricing: 10000=0,007, 20000=0,008 (USD); Mounting Technology: Surface Mount; Pins: 2; Package Shape: Rectangular; Case/Package: 0402; Terminal Finish: Nickel; Min Operating Temperature: -55°C; Max Operating Temperature: 85°C; JESD-609 Code: e3; Capacitor Type: Ceramic; Package Style: SMTMeter; Packaging: Tape and Reel; Tolerance (fill in as +-): 10%; Rated DC Voltage (URdc): 16V; Temperature Characteristics Code: X5R; Termination: Wraparound; Length: 1mm; Width: 0.5mm; Height: 0.5mm; Reach SVHC Compliant: Yes; RoHS Compliant: Yes; ComponentLink1URL: https://datasheet.ciiva.com:443/pdfs/VipMasterIC/IC/TAIY/TAIY-S-A0009096450/TAIY-S-A0009096597-1.pdf?src-supplier=IHS+Markit; ComponentLink1Description: https://datasheet.ciiva.com:443/pdfs/VipMasterIC/IC/TAIY/TAIY-S-A0009096450/TAIY-S-A0009096597-1.pdf?src-supplier=IHS+Markit; ComponentLink2URL: https://datasheet.ciiva.com/134/emk105bj105kv-f-ss-134209.pdf?src-supplier=Digikey; ComponentLink2Description: https://datasheet.ciiva.com/134/emk105bj105kv-f-ss-134209.pdf?src-supplier=Digikey; ComponentLink3URL: https://datasheet.ciiva.com/30259/265emk105bj105kv-f-30259872.pdf?src-supplier=Onlinecomponents.com; ComponentLink3Description: https://datasheet.ciiva.com/30259/265emk105bj105kv-f-30259872.pdf?src-supplier=Onlinecomponents.com; ComponentLink4URL: https://datasheet.ciiva.com/15920/964emk105bj105kv-f-15920402.pdf?src-supplier=Onlinecomponents.com; ComponentLink4Description: https://datasheet.ciiva.com/15920/964emk105bj105kv-f-15920402.pdf?src-supplier=Onlinecomponents.com; ComponentLink5URL: https://datasheet.ciiva.com/26871/getdatasheetpartid-638287-26871289.pdf?src-supplier=Verical; ComponentLink5Description: https://datasheet.ciiva.com/26871/getdatasheetpartid-638287-26871289.pdf?src-supplier=Verical; ComponentLink6URL: https://datasheet.ciiva.com/5424/mlcc01-e-5424190.pdf?src-supplier=Mouser; ComponentLink6Description: https://datasheet.ciiva.com/5424/mlcc01-e-5424190.pdf?src-supplier=Mouser; ComponentLink7URL: https://datasheet.ciiva.com/22694/1497285-22694239.pdf?src-supplier=Element14; ComponentLink7Description: https://datasheet.ciiva.com/22694/1497285-22694239.pdf?src-supplier=Element14; ComponentLink8URL: https://datasheet.ciiva.com/7657/1497285-7657320.pdf?src-supplier=Element14; ComponentLink8Description: https://datasheet.ciiva.com/7657/1497285-7657320.pdf?src-supplier=Element14; .PCBChecked: *; .SCHChecked: *
CN1 = USB4085-GF-A: CONN - CONN RCPT USB2.0 TYPE C 16+8POS; Manufacturer 1: GCT; MF: Global Connector Technology; .Mounting: PTH; SnapEDA_Link: https://www.snapeda.com/parts/USB4085-GF-A/Global+Connector+Technology/view-part/?ref=snap; Package: None; Value: *; Check_prices: https://www.snapeda.com/parts/USB4085-GF-A/Global+Connector+Technology/view-part/?ref=eda; Manufacturer Part Number 1: USB4085-GF-A; .PCBChecked: *; .SCHChecked: *; Supplier 1: DigiKey; Supplier Part Number 1: 2073-USB4085-GF-ACT-ND
D1 = STN161050U852: DIODE - TVS - 17V Clamp 110A (8/20µs) Ipp Tvs Diode Surface Mount DFN1610-2L; Manufacturer 1: Eaton Bussmann; .Mounting: SMT; Supplier: Digikey; Supplier Part Number: 283-STN161050U852CT-ND; RoHS: No; Category: TVS Diodes; Stock: 8977; Pricing: 1=0,36, 10=0,25, 100=0,133, 500=0,119, 1000=0,101 (USD); ComponentLink1URL: https://datasheet.octopart.com/STN161050U852-Cooper-Bussmann-datasheet-154846660.pdf?src-supplier=Sager+Electronics; ComponentLink1Description: https://datasheet.octopart.com/STN161050U852-Cooper-Bussmann-datasheet-154846660.pdf?src-supplier=Sager+Electronics; .PCBChecked: *; .SCHChecked: *; Manufacturer Part Number 1: STN161050U852
D2 D3 = TPD1E0B04DPYR: DIODE - TVS - 19V Clamp 1.7A (8/20µs) Ipp Tvs Diode Surface Mount 2-X1SON (1x.60); Manufacturer 1: Texas Instruments; Diode Type: TRANS VOLTAGE SUPPRESSOR; .Mounting: SMT; Supplier: Digikey; Supplier Part Number: 296-47864-1-ND; RoHS: Yes; Category: Integrated Circuits (ICs); Stock: 1526; Pricing: 1=0,32, 10=0,216, 100=0,095, 500=0,09, 1000=0,085, 2000=0,0835, 5000=0,082 (USD); Terminal Finish: Nickel; JESD-609 Code: e4; Moisture Sensitivity Level: 1; Reach SVHC Compliant: Yes; RoHS Compliant: Yes; ComponentLink1URL: https://www.ti.com:443/lit/ds/symlink/tpd1e0b04.pdf?src-supplier=IHS+Markit; ComponentLink1Description: https://www.ti.com:443/lit/ds/symlink/tpd1e0b04.pdf?src-supplier=IHS+Markit; ComponentLink2URL: http://www.ti.com/lit/ds/symlink/tpd1e0b04.pdf?src-supplier=Digikey; ComponentLink2Description: http://www.ti.com/lit/ds/symlink/tpd1e0b04.pdf?src-supplier=Digikey; ComponentLink3URL: http://www.ti.com/general/docs/suppproductinfo.tsp?distId=10&amp;gotoUrl=http%3A%2F%2Fwww.ti.com%2Flit%2Fgpn%2Ftpd1e0b04&src-supplier=Digikey; ComponentLink3Description: http://www.ti.com/general/docs/suppproductinfo.tsp?distId=10&amp;gotoUrl=http%3A%2F%2Fwww.ti.com%2Flit%2Fgpn%2Ftpd1e0b04&src-supplier=Digikey; .PCBChecked: *; .SCHChecked: *; Manufacturer Part Number 1: TPD1E0B04DPYR
D4 = LTST-C190KRKT: DIODE - LED Red 631nm LED Indication - Discrete 2V 0603 (1608 Metric); Manufacturer 1: Vishay Lite-On; Shape: Rectangular; Lens Style: WATER CLEAR; Forward Current: 30mA; Forward Voltage: 2.4V; Luminous Intensity-Min: 130cd; Luminous Intensity-Nom: 54mcd; Channels: 1; Optoelectronic Device Type: SINGLE COLOR LED; Reverse Voltage-Max: 5V; Viewing Angle: 130°; Overall Height: 0.8mm; .Mounting: SMT; Supplier: Digikey; Supplier Part Number: 160-1436-1-ND; RoHS: Yes; Category: LEDs; Stock: 23487; Pricing: 1=0,14, 10=0,094, 100=0,0649, 500=0,05134, 1000=0,04682, 2000=0,04295 (USD); Mounting Technology: Surface Mount; Pins: 2; Color: Red; Color@wavelength: Red; Min Operating Temperature: -30°C; Max Operating Temperature: 85°C; Packaging: Tape and Reel; Size: 1.1mm; Terminal Pitch: 1.5mm; Reach SVHC Compliant: Yes; RoHS Compliant: Yes; ComponentLink1URL: https://datasheet.ciiva.com:443/pdfs/VipMasterIC/IC/LITE/LITE-S-A0003370447/LITE-S-A0003370447-1.pdf?src-supplier=IHS+Markit; ComponentLink1Description: https://datasheet.ciiva.com:443/pdfs/VipMasterIC/IC/LITE/LITE-S-A0003370447/LITE-S-A0003370447-1.pdf?src-supplier=IHS+Markit; ComponentLink2URL: https://datasheet.ciiva.com/11774/0900766b80dc02a9-11774043.pdf?src-supplier=Rs; ComponentLink2Description: https://datasheet.ciiva.com/11774/0900766b80dc02a9-11774043.pdf?src-supplier=Rs; ComponentLink3URL: https://datasheet.ciiva.com/12403/100-ltst-c190krkt-59805-12403895.pdf?src-supplier=Mouser; ComponentLink3Description: https://datasheet.ciiva.com/12403/100-ltst-c190krkt-59805-12403895.pdf?src-supplier=Mouser; ComponentLink4URL: https://datasheet.ciiva.com/16427/ltst-c190krkt-16427674.pdf?src-supplier=Future+Electronics; ComponentLink4Description: https://datasheet.ciiva.com/16427/ltst-c190krkt-16427674.pdf?src-supplier=Future+Electronics; ComponentLink5URL: https://datasheet.ciiva.com/19482/1260381-19482354.pdf?src-supplier=Jameco; ComponentLink5Description: https://datasheet.ciiva.com/19482/1260381-19482354.pdf?src-supplier=Jameco; ComponentLink6URL: https://datasheet.ciiva.com/15117/getdatasheetpartid-57395-15117240.pdf?src-supplier=Verical; ComponentLink6Description: https://datasheet.ciiva.com/15117/getdatasheetpartid-57395-15117240.pdf?src-supplier=Verical; ComponentLink7URL: https://datasheet.ciiva.com/2109/s-110-ltst-c190krkt-2109991.pdf?src-supplier=Digikey; ComponentLink7Description: https://datasheet.ciiva.com/2109/s-110-ltst-c190krkt-2109991.pdf?src-supplier=Digikey; ComponentLink8URL: https://datasheet.ciiva.com/2109/s-110-ltst-c190krkt-2109992.pdf?src-supplier=Digikey; ComponentLink8Description: https://datasheet.ciiva.com/2109/s-110-ltst-c190krkt-2109992.pdf?src-supplier=Digikey; ComponentLink9URL: https://datasheet.ciiva.com/2109/s-110-ltst-c190krkt-2109993.pdf?src-supplier=Digikey; ComponentLink9Description: https://datasheet.ciiva.com/2109/s-110-ltst-c190krkt-2109993.pdf?src-supplier=Digikey; ComponentLink10URL: https://datasheet.ciiva.com/26937/getdatasheetpartid-631582-26937958.pdf?src-supplier=Verical; ComponentLink10Description: https://datasheet.ciiva.com/26937/getdatasheetpartid-631582-26937958.pdf?src-supplier=Verical; .PCBChecked: *; .SCHChecked: *; Manufacturer Part Number 1: LTST-C190KRKT
R1 R2 = ERA-2ARC512X: RES - 5K1 Ohm 1/16W 0402 ±0.25% 50V; Manufacturer 1: Panasonic; .Mounting: SMT; Value: 5.1K; Supplier: Mouser; Supplier Part Number: 667-ERA-2ARC512X; RoHS: Yes; Category: Chip SMD Resistors; Stock: 3234; Pricing: 1=0,21, 10=0,177, 50=0,157, 100=0,147, 1000=0,121, 10000=0,104 (USD); ComponentLink1URL: https://industrial.panasonic.com/cdbs/www-data/pdf/RDM0000/AOA0000C307.pdf?src-supplier=Digikey; ComponentLink1Description: https://industrial.panasonic.com/cdbs/www-data/pdf/RDM0000/AOA0000C307.pdf?src-supplier=Digikey; .SCHChecked: *; .PCBChecked: *; Manufacturer Part Number 1: ERA-2ARC512X
R3 = RC1005F103CS: as R34 on sheet [03] - MICROCONTROLLER; Supplier: Digikey; Supplier Part Number: 1276-3431-1-ND; Manufacturer Part Number 1: RC1005F103CS; RoHS: Yes; Category: Chip SMD Resistors; Stock: 10935408; Pricing: 1=0,1, 10=0,039, 100=0,0201, 1000=0,01175, 2500=0,0099, 5000=0,00882 (USD); Mounting Technology: Surface Mount; Pins: 2; Package Shape: Rectangular; Case/Package: 0402; Terminal Finish: Nickel; Min Operating Temperature: -55°C; Max Operating Temperature: 125°C; Tolerance: 1%; JESD-609 Code: e3; Resistor Type: FIXED RESISTOR; Construction: Chip; Packaging: Tape and Reel; Technology: METAL GLAZE/THICK FILM; Reach SVHC Compliant: Yes; RoHS Compliant: Yes; ComponentLink1URL: https://datasheet.ciiva.com:443/pdfs/VipMasterIC/IC/SEMS/SEMS-S-A0001326806/SEMS-S-A0001326806-1.pdf?src-supplier=IHS+Markit; ComponentLink1Description: https://datasheet.ciiva.com:443/pdfs/VipMasterIC/IC/SEMS/SEMS-S-A0001326806/SEMS-S-A0001326806-1.pdf?src-supplier=IHS+Markit; ComponentLink2URL: https://datasheet.ciiva.com/15196/getdatasheetpartid-504789-15196214.pdf?src-supplier=Verical; ComponentLink2Description: https://datasheet.ciiva.com/15196/getdatasheetpartid-504789-15196214.pdf?src-supplier=Verical; ComponentLink3URL: https://datasheet.ciiva.com/16481/rcseries-16481007.pdf?src-supplier=Future+Electronics; ComponentLink3Description: https://datasheet.ciiva.com/16481/rcseries-16481007.pdf?src-supplier=Future+Electronics; .PCBChecked: *; .SCHChecked: *
U1 = TLV75533PDBVR: LDO - Fixed Regulator 3.3V 500mA SOT-23-5; Manufacturer 1: Texas Instruments; Regulator Type: FIXED POSITIVE SINGLE OUTPUT LDO REGULATOR; .Mounting: SMT; Supplier 1: Mouser; Supplier Part Number 1: 595-TLV75533PDBVR; Manufacturer Part Number 1: TLV75533PDBVR; RoHS: Yes; Category: Voltage Regulators - Linear; Stock: 22700; Pricing: 1=0,32, 10=0,218, 50=0,194, 100=0,167, 1000=0,14, 10000=0,123 (USD); Terminal Finish: Tin; JESD-609 Code: e3; Moisture Sensitivity Level: 1; Reach SVHC Compliant: Yes; RoHS Compliant: Yes; ComponentLink1URL: https://www.ti.com:443/lit/ds/symlink/tlv755p.pdf?src-supplier=IHS+Markit; ComponentLink1Description: https://www.ti.com:443/lit/ds/symlink/tlv755p.pdf?src-supplier=IHS+Markit; ComponentLink2URL: http://www.ti.com/lit/ds/symlink/tlv755p.pdf?src-supplier=Digikey; ComponentLink2Description: http://www.ti.com/lit/ds/symlink/tlv755p.pdf?src-supplier=Digikey; ComponentLink3URL: http://www.ti.com/general/docs/suppproductinfo.tsp?distId=10&amp;gotoUrl=http%3A%2F%2Fwww.ti.com%2Flit%2Fgpn%2Ftlv755p&src-supplier=Digikey; ComponentLink3Description: http://www.ti.com/general/docs/suppproductinfo.tsp?distId=10&amp;gotoUrl=http%3A%2F%2Fwww.ti.com%2Flit%2Fgpn%2Ftlv755p&src-supplier=Digikey; .PCBChecked: *; .SCHChecked: *